# Altium schematic sheet al115v20_relays.SchDoc
size A4; DrawnBy: Suraj K A; Engineer: Suraj K A; Organization: Simcons Control Systems; Address1: HMT Colony PO; Address2: Kalamassery; Address3: Cochin; Address4: India
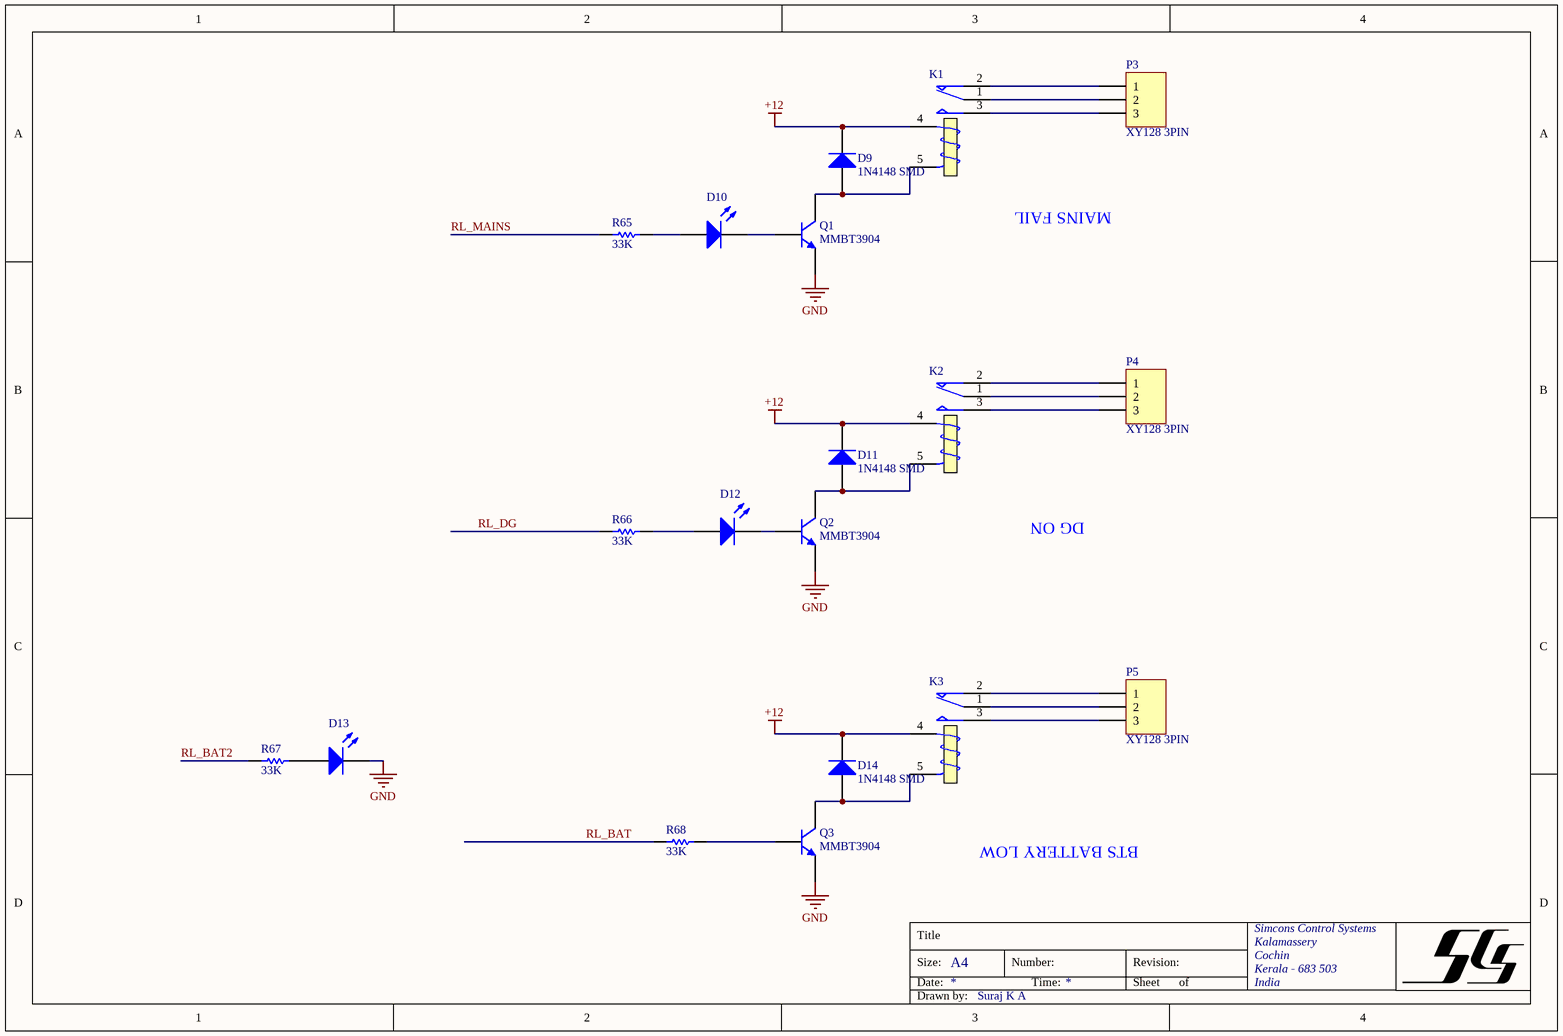
[diagram p0: al115v20_relays.SchDoc]

## Parts
D9  1N4148 SMD  [4148SMDW]
D10  LED R/R 5MM  [LEDSMALL]  (value not drawn)
D11  1N4148 SMD  [4148SMDW]
D12  LED R/R 5MM  [LEDSMALL]  (value not drawn)
D13  LED R/R 5MM  [LEDSMALL]  (value not drawn)
D14  1N4148 SMD  [4148SMDW]
K1  Relay  [RELAY]  (value not drawn)
K2  Relay  [RELAY]  (value not drawn)
K3  Relay  [RELAY]  (value not drawn)
P3  XY128 3PIN  [XY128_5.08_3PIN]
P4  XY128 3PIN  [XY128_5.08_3PIN]
P5  XY128 3PIN  [XY128_5.08_3PIN]
Q1  MMBT3904  [SOT23_M]
Q2  MMBT3904  [SOT23_M]
Q3  MMBT3904  [SOT23_M]
R65  value 33K  [R1206]  (hidden comment: 330E 1206)
R66  value 33K  [R1206]  (hidden comment: 330E 1206)
R67  value 33K  [R1206]  (hidden comment: 330E 1206)
R68  value 33K  [R1206]  (hidden comment: 4.7K 1206)

## Nets
+12: D9.2(K) D11.2(K) D14.2(K) K1.4(T1) K2.4(T1) K3.4(T1)
GND: D13.2(K) Q1.2(E) Q2.2(E) Q3.2(E)
RL_BAT: R68.2
RL_BAT2: R67.1
RL_DG: R66.2
RL_MAINS: R65.2
NetD9_1: D9.1(A) K1.5(T2) Q1.3(C)
NetD10_1: D10.1(A) R65.1
NetD10_2: D10.2(K) Q1.1(B)
NetD11_1: D11.1(A) K2.5(T2) Q2.3(C)
NetD12_1: D12.1(A) R66.1
NetD12_2: D12.2(K) Q2.1(B)
NetD13_1: D13.1(A) R67.2
NetD14_1: D14.1(A) K3.5(T2) Q3.3(C)
NetK1_1: K1.1(COM) P3.2
NetK1_2: K1.2(NC) P3.1
NetK1_3: K1.3(NO) P3.3
NetK2_1: K2.1(COM) P4.2
NetK2_2: K2.2(NC) P4.1
NetK2_3: K2.3(NO) P4.3
NetK3_1: K3.1(COM) P5.2
NetK3_2: K3.2(NC) P5.1
NetK3_3: K3.3(NO) P5.3
NetQ3_1: Q3.1(B) R68.1

## Notes on the sheet
- MAINS FAIL
- DG ON
- BTS BATTERY LOW
- Title
- Size:
- Date:
- A4
- Number:
- Time:
- Revision:
- Sheet
- of
- Simcons Control Systems
- Kalamassery
- Cochin
- Kerala - 683 503
- India
- Drawn by:

## Library data of the parts
D9 D11 D14 = Diode: Default Diode; Published: 8-Jun-2000; LatestRevisionDate: 17-Jul-2002; LatestRevisionNote: Re-released for DXP Platform.; PackageVersion: Sep-1996; PackageReference: SMC; Publisher: Altium Limited; PackageDescription: DO-214-AB/SMC; 2 C-Bend Leads; Body 7.9 x 5.9 mm, inc. leads (LxW); Code_JEDEC: DO-214-AB
D10 D12 D13 = LED1: Typical RED GaAs LED; Published: 8-Jun-2000; LatestRevisionDate: 08-Jul-2005; LatestRevisionNote: Mech Layer 1 removed.; PackageReference: LED-1; Publisher: Altium Limited; PackageDescription: LED; 2 Leads
K1-K3 = Relay: SPDT Relay; Published: 8-Jun-2000; LatestRevisionDate: 17-Jul-2002; LatestRevisionNote: Re-released for DXP Platform.; PackageReference: MODULE5B; Publisher: Altium Limited
P3-P5 = Header 3: Header, 3-Pin; LatestRevisionDate: 17-Jul-2002; LatestRevisionNote: Re-released for DXP Platform.; Publisher: Altium Limited
Q1-Q3 = BC847: NPN General-purpose Transistor; Published: 17-Sep-2003; LatestRevisionDate: 12-Dec-2006; LatestRevisionNote: IPC-7351 Footprint Added.; DatasheetVersion: 4-Feb-2002; PackageVersion: May-1999; PackageReference: SOT23; Publisher: Altium Limited; PackageDescription: 3-Pin SOT-23 Package 0.95 mm Pitch, 2.3 mm Lead Span; ComponentLink1Description: Manufacturer Link; ComponentLink1URL: http://www.semiconductors.philips.com/; ComponentLink2Description: Datasheet; ComponentLink2URL: http://www.semiconductors.philips.com/acrobat/datasheets/BC846_BC847_BC848_5.pdf
R65-R68 = Res Semi: Semiconductor Resistor; Published: 8-Jun-2000; LatestRevisionDate: 17-Jul-2002; LatestRevisionNote: Re-released for DXP Platform.; PackageReference: AXIAL-0.5; Publisher: Altium Limited; PackageDescription: Axial Device, Thru-Hole; 2 Leads; 0.5 in Pin Spacing